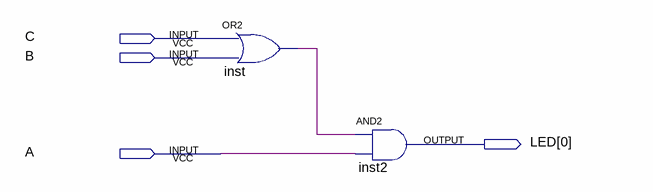
[diagram p0: schematic sheet]
// Quartus schematic Ex_2.bdf as structural Verilog: 2 symbols, 4 pins
module Ex_2 (
  input  C,
  input  B,
  input  A,
  output [0:0] LED
);

  wire inst_out;

  or inst (inst_out, C, B);
  // AND2 inst2 has open pins: IN1=inst_out, IN2=A, OUT=open
endmodule
